# Altium project MCPS Supply 0305.PrjPcb
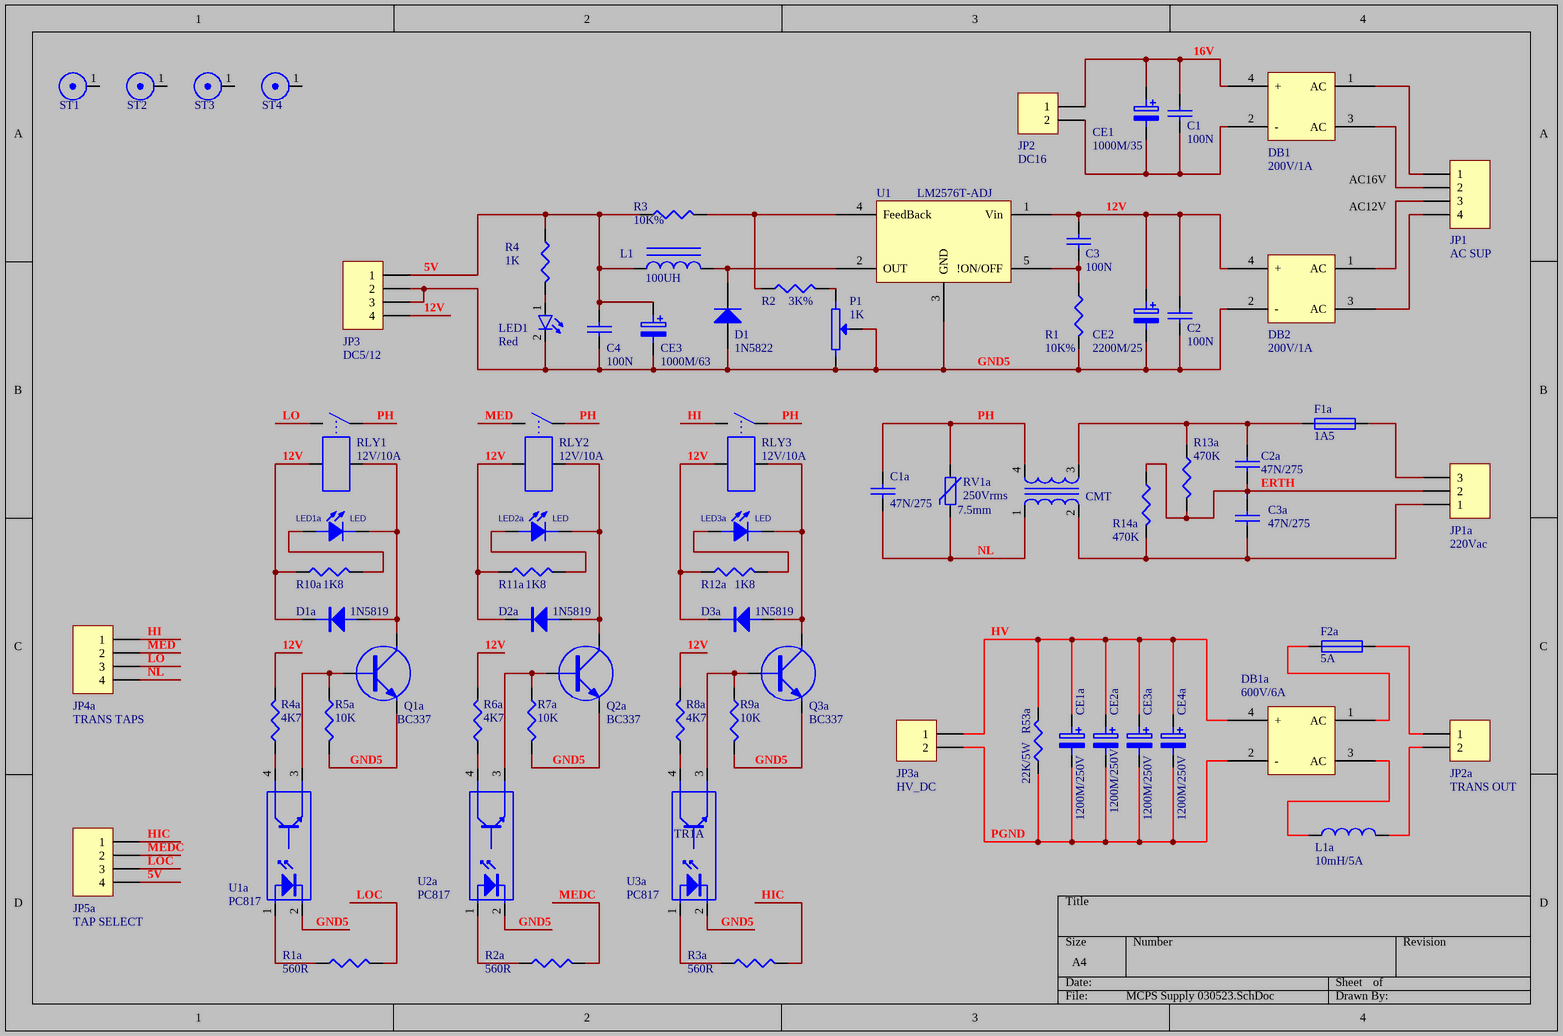
[diagram p0: MCPS Supply 030523.SchDoc]
1 sheet, 73 parts. Net scope: global (net labels, ports and power ports of the same name join across sheets).
Board file: MCPS Supply 030523.PcbDoc

## Sheet MCPS Supply 030523.SchDoc
size A4

### Parts
C1  100N  [c1.8p]
C1a  47N/275  [47N275]
C2  100N  [c1.8p]
C2a  47N/275  [47N275]
C3  100N  [C3P]
C3a  47N/275  [47N275]
C4  100N  [c1.8p]
CE1  1000M/35  [CAP3P]
CE1a  1200M/250V  [CAP5P]
CE2  2200M/25  [CAP3P]
CE2a  1200M/250V  [CAP5P]
CE3  1000M/63  [CAP2P]
CE3a  1200M/250V  [CAP5P]
CE4a  1200M/250V  [CAP5P]
D1  1N5822  [d54]
D1a  1N5819  [D54]
D2a  1N5819  [D54]
D3a  1N5819  [D54]
DB1  200V/1A  [BRG GBU]
DB1a  600V/6A  [BRIDGE S]
DB2  200V/1A  [BRG GBU]
F1a  1A5  [FS]
F2a  5A  [FS]
JP1  AC SUP
JP1a  220Vac  [3EDG-str]
JP2  DC16  [2edg-str]
JP2a  TRANS OUT  [2edg-str]
JP3  DC5/12
JP3a  HV_DC  [DG55X2]
JP4a  TRANS TAPS
JP5a  TAP SELECT
L1  100UH  [Inductor2512]
L1a  10mH/5A  [INDUCTOR2208]
LED1  Red  [LED-5mm]
LED1a  LED  [LED-5mm]
LED2a  LED  [LED-5mm]
LED3a  LED  [LED-5mm]
P1  1K  [pot multi turn]
Q1a  BC337  [139]
Q2a  BC337  [139]
Q3a  BC337  [139]
R1  10K%  [R4P]
R1a  560R  [R4P]
R2  3K%  [R4P]
R2a  560R  [R4P]
R3  10K%  [R4P]
R3a  560R  [R4P]
R4  1K  [R4P]
R4a  4K7  [R4P]
R5a  10K  [R4P]
R6a  4K7  [R4P]
R7a  10K  [R4P]
R8a  4K7  [R4P]
R9a  10K  [R4P]
R10a  1K8  [R4P]
R11a  1K8  [R4P]
R12a  1K8  [R4P]
R13a  470K  [R5P]
R14a  470K  [R5P]
R53a  22K/5W  [R4P]
RLY1  12V/10A
RLY2  12V/10A
RLY3  12V/10A
RV1a  250Vrms  [VARISTOR3]
ST1  STUD  [CORNER]  (value not drawn)
ST2  STUD  [CORNER]  (value not drawn)
ST3  STUD  [CORNER]  (value not drawn)
ST4  STUD  [CORNER]  (value not drawn)
TR1A  CMT  [CMT1]
U1  LM2576T-ADJ  [PENTA1]
U1a  PC817  [DIP4]
U2a  PC817  [DIP4]
U3a  PC817  [DIP4]

### Nets
5V: C4.1 CE3.1 JP3.1 JP5a.4 L1.1 R3.1 R4.1
12V: C2.1 C3.1 CE2.1 D1a.2(K) D2a.2(K) D3a.2(K) DB2.4(+) JP3.4 R4a.2 R6a.2 R8a.2 R10a.1 R11a.1 R12a.1 RLY1.5 RLY2.5 RLY3.5 U1.1(Vin)
16V: C1.1 CE1.1 DB1.4(+) JP2.1
ERTH: C2a.2 C3a.1 JP1a.2 R13a.2 R14a.1
GND5: C2.2 C4.2 CE2.2 CE3.2 D1.1(A) DB2.2(-) JP3.2 JP3.3 LED1.2(K) P1.2 P1.3 Q1a.1(E) Q2a.1(E) Q3a.1(E) R1.2 R5a.2 R7a.2 R9a.2 U1.3(GND) U1a.2(K) U2a.2(K) U3a.2(K)
HI: JP4a.1 RLY3.2
HIC: JP5a.1 R3a.2
HV: CE1a.1 CE2a.1 CE3a.1 CE4a.1 DB1a.4(+) JP3a.1 R53a.2
LO: JP4a.3 RLY1.2
LOC: JP5a.3 R1a.2
MED: JP4a.2 RLY2.2
MEDC: JP5a.2 R2a.2
NL: C1a.2 JP4a.4 RV1a.2 TR1A.1
PGND: CE1a.2 CE2a.2 CE3a.2 CE4a.2 DB1a.2(-) JP3a.2 R53a.1
PH: C1a.1 RLY1.1 RLY2.1 RLY3.1 RV1a.1 TR1A.4
NetC1_2: C1.2 CE1.2 DB1.2(-) JP2.2
NetC2a_1: C2a.1 F1a.2 R13a.1 TR1A.3
NetC3_2: C3.2 R1.1 U1.5(!ON/OFF)
NetC3a_2: C3a.2 JP1a.1 R14a.2 TR1A.2
NetD1_2: D1.2(K) L1.2 U1.2(OUT)
NetD1a_1: D1a.1(A) LED1a.2(CATHODE) Q1a.3(C) RLY1.4
NetD2a_1: D2a.1(A) LED2a.2(CATHODE) Q2a.3(C) RLY2.4
NetD3a_1: D3a.1(A) LED3a.2(CATHODE) Q3a.3(C) RLY3.4
NetDB1_1: DB1.1(AC) JP1.1
NetDB1_3: DB1.3(AC) JP1.2
NetDB1a_1: DB1a.1(AC) F2a.1
NetDB1a_3: DB1a.3(AC) L1a.1
NetDB2_1: DB2.1(AC) JP1.3
NetDB2_3: DB2.3(AC) JP1.4
NetF1a_1: F1a.1 JP1a.3
NetF2a_2: F2a.2 JP2a.1
NetJP2a_2: JP2a.2 L1a.2
NetLED1_1: LED1.1(A) R4.2
NetLED1a_1: LED1a.1(ANODE) R10a.2
NetLED2a_1: LED2a.1(ANODE) R11a.2
NetLED3a_1: LED3a.1(ANODE) R12a.2
NetP1_1: P1.1 R2.2
NetQ1a_2: Q1a.2(B) R5a.1 U1a.3(E)
NetQ2a_2: Q2a.2(B) R7a.1 U2a.3(E)
NetQ3a_2: Q3a.2(B) R9a.1 U3a.3(E)
NetR1a_1: R1a.1 U1a.1(A)
NetR2_1: R2.1 R3.2 U1.4(FeedBack)
NetR2a_1: R2a.1 U2a.1(A)
NetR3a_1: R3a.1 U3a.1(A)
NetR4a_1: R4a.1 U1a.4(C)
NetR6a_1: R6a.1 U2a.4(C)
NetR8a_1: R8a.1 U3a.4(C)

Not connected (* = marked no-connect by the designer): ST1 1; ST2 1; ST3 1; ST4 1

### Notes on the sheet
- AC12V
- AC16V
- (near RV1a) 7.5mm

### Library data of the parts
C1 C1a C2 C2a C3 C3a C4 = C
CE1 CE1a CE2 CE2a CE3 CE3a CE4a = E
D1 = Diode: Default Diode; Published: 8-Jun-2000; LatestRevisionDate: 17-Jul-2002; LatestRevisionNote: Re-released for DXP Platform.; PackageVersion: Sep-1996; PackageReference: SMC; Publisher: Altium Limited; PackageDescription: DO-214-AB/SMC; 2 C-Bend Leads; Body 7.9 x 5.9 mm, inc. leads (LxW); Code_JEDEC: DO-214-AB
D1a D2a D3a = D: D4P: *
DB1 DB1a DB2 = BRIDGE
F1a F2a = FUSE1
JP1 JP3 JP4a JP5a = Header 4: Header, 4-Pin; LatestRevisionDate: 17-Jul-2002; LatestRevisionNote: Re-released for DXP Platform.; Publisher: Altium Limited
JP1a = Header 3: Header, 3-Pin; LatestRevisionDate: 17-Jul-2002; LatestRevisionNote: Re-released for DXP Platform.; Publisher: Altium Limited
JP2 JP2a JP3a = Header 2: Header, 2-Pin; LatestRevisionDate: 17-Jul-2002; LatestRevisionNote: Re-released for DXP Platform.; Publisher: Altium Limited
L1 = INDUCTOR IRON
L1a = INDUCTOR
LED1 = LED: Designer: Saeid Jorablo; Organazation: ControTec; Adding Date: 1387/12/22; Color: Red; Size: SMD 1206
LED1a LED2a LED3a = LED: LED LIGHTING; Designer: Abbas Basereh; Data: 16-12-2016; Link: *; Part.No: *
P1 = POT2
Q1a Q2a Q3a = N
R1 R1a R2 R2a R3 R3a R4 R4a R5a R6a R7a R8a R9a R10a R11a R12a R13a R14a R53a = R
RLY1-RLY3 = RELAY-SPST4
RV1a = VARISTOR
TR1A = TRANS1
U1 = LM2576
U1a U2a U3a = OPTODIP4